# Altium project Taksimetre.PrjPcb (part 2 of 2)

## Sheet 01_Power_Regulations.SchDoc
size A4; DrawnBy: YILDIRIM DOĞRU
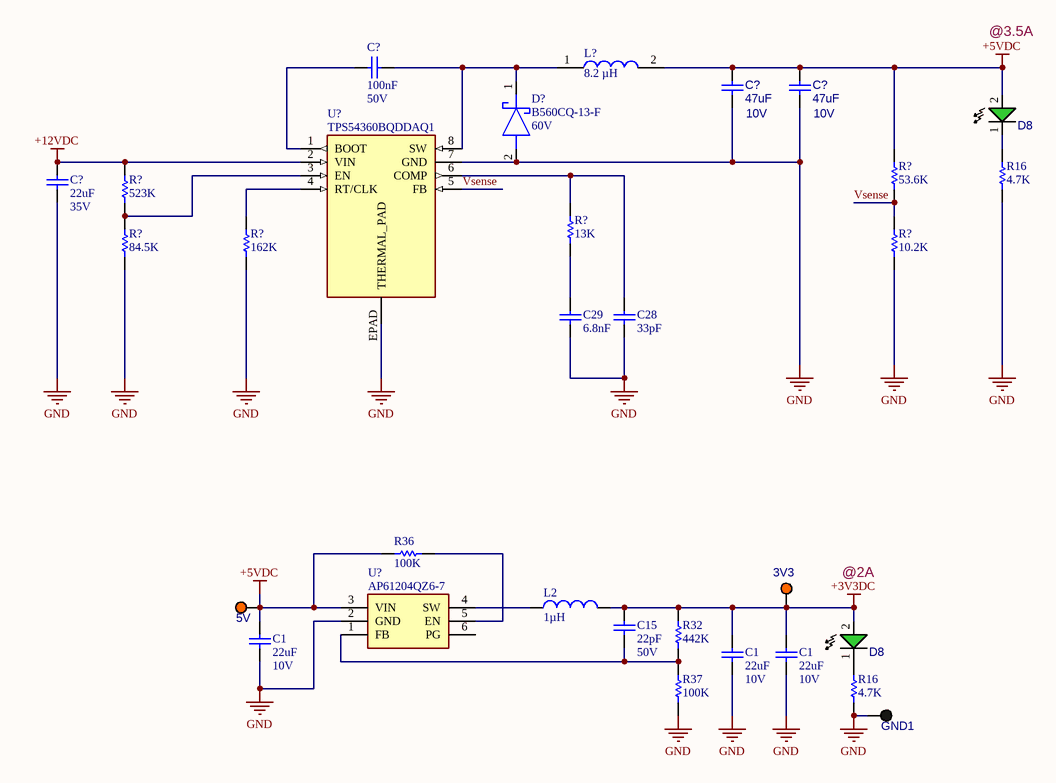
[diagram p9: 01_Power_Regulations.SchDoc]

### Parts
(Parts that share a designator on the sheet are numbered #1, #2 ... from top to bottom, then left to right.)
3V3  L-KLS8-TP5003  [TEST_POINT_ORANGE]  (value not drawn)
5V  L-KLS8-TP5003  [TEST_POINT_ORANGE]  (value not drawn)
C1#2  value 22uF  Voltage: 10V  [CAP_0805]  (hidden comment: CL21A226MPCLRNC)
C1#3  value 22uF  Voltage: 10V  [CAP_0805]  (hidden comment: CL21A226MPCLRNC)
C1#4  value 22uF  Voltage: 10V  [CAP_0805]  (hidden comment: CL21A226MPCLRNC)
C15#2  value 22pF  Voltage: 50V  [CAP_0603]  (hidden comment: CAP)
C28#2  value 33pF  [CAP_0603]  (hidden comment: CL10C330JB8NNNC)
C29#2  value 6.8nF  [CAP_0603]  (hidden comment: CC0603KRX7R9BB682)
C?#23  value 100nF  Voltage: 50V  [CAP_0603]  (hidden comment: CAP)
C?#24  value 47uF  Voltage: 10V  [CAP_1206]  (hidden comment: CL31A476MPHNNNE)
C?#25  value 47uF  Voltage: 10V  [CAP_1206]  (hidden comment: CL31A476MPHNNNE)
C?#26  value 22uF  Voltage: 35V  [CAP_0805]  (hidden comment: GMC21X5R226M35NT)
D8#2  LTST-C190TGKT  [LED_0603_GREEN]  (value not drawn)
D8#3  LTST-C190TGKT  [LED_0603_GREEN]  (value not drawn)
D?#11  B560CQ-13-F  value 60V  [DIOM7959X250N]
GND1  L-KLS8-TP5001  [TEST_POINT_BLACK]  (value not drawn)
L2#2  value 1µH  [FPI0302-2R2M]  (hidden comment: FPI0302-1R0M)
L?#2  value 8.2 µH  [7447797360]  (hidden comment: 7447797820)
R16#6  value 4.7K  [RES_0603]  (hidden comment: 0603SAF4701T5E)
R16#7  value 4.7K  [RES_0603]  (hidden comment: 0603SAF4701T5E)
R32  value 442K  [RES_0603]  (hidden comment: RES)
R36  value 100K  [RES_0603]  (hidden comment: RES)
R37  value 100K  [RES_0603]  (hidden comment: RES)
R?#29  value 53.6K  [RES_0402]  (hidden comment: 0402WGF5362TCE)
R?#30  value 523K  [RES_0402]  (hidden comment: 0402WGF5233TCE)
R?#31  value 10.2K  [RES_0402]  (hidden comment: 0402WGF1022TCE)
R?#32  value 13K  [RES_0402]  (hidden comment: 0402WGF1302TCE)
R?#33  value 84.5K  [RES_0402]  (hidden comment: 0402WGF8452TCE)
R?#34  value 162K  [RES_0402]  (hidden comment: 0402WGF1623TCE)
U?#7  TPS54360BQDDAQ1  [DDA8_3P1X2P4_TEX]
U?#8  AP61204QZ6-7  [AP61204QZ67]

### Nets
+3V3DC: 3V3.1 C1#3.1 C1#4.1 C15#2.1 D8#3.2 L2#2.2 R32.1
+5VDC: 5V.1 C1#2.1 C?#24.1 C?#25.1 D8#2.2 L?#2.2 R36.1 R?#29.1 U?#8.3(VIN)
+12VDC: C?#26.1 R?#30.2 U?#7.2(VIN)
GND: C1#2.2 C1#3.2 C1#4.2 C28#2.2 C29#2.2 C?#24.2 C?#25.2 C?#26.2 D?#11.2(A) GND1.1 R16#6.1 R16#7.1 R37.1 R?#31.2 R?#33.1 R?#34.1 U?#7.7(GND) U?#7.EPAD(THERMAL_PAD) U?#8.2(GND)  [project net TVSS]
Vsense: R?#29.2 R?#31.1 U?#7.5(FB)
NetC15#2_2: C15#2.2 R32.2 R37.2 U?#8.1(FB)
NetC28#2_1: C28#2.1 R?#32.2 U?#7.6(COMP)
NetC29#2_1: C29#2.1 R?#32.1
NetC?#23_1: C?#23.1 U?#7.1(BOOT)
NetC?#23_2: C?#23.2 D?#11.1(K) L?#2.1 U?#7.8(SW)
NetD8#2_1: D8#2.1 R16#6.2
NetD8#3_1: D8#3.1 R16#7.2
NetL2#2_1: L2#2.1 U?#8.4(SW)
NetR36_2: R36.2 U?#8.5(EN)
NetR?#30_1: R?#30.1 R?#33.2 U?#7.3(EN)
NetR?#34_2: R?#34.2 U?#7.4(RT/CLK)

Not connected (* = marked no-connect by the designer): U?#8 6(PG)

### Notes on the sheet
- @3.5A
- @2A
- Title
- Size:
- Date:
- A4
- Drawn By:
- Number:
- Revision:
- File:

### Library data of the parts
3V3 5V = 5003: PC TEST POINT MINIATURE ORANGE 2.54MMX4.60MM; Manufacturer: KLS ELECTRONIC; Package: 1mm THT Pad; Manufacturer Part Number: L-KLS8-TP5003
C1#2-C1#4 = C01758: MLCC (2012) 0805 22uF 10VDC ±20% X5R; Manufacturer: Samsung; Manufacturer Part Number: CL21A226MPCLRNC
C15#2 = C01769: MLCC 0603 22pF 50VDC ±5% C0G (NP0); Manufacturer: Samsung; Manufacturer Part Number: CL10C220JB8NNNC
C28#2 = CL10C330JB8NNNC: MLCC (1608) 0603 33pF 50VDC ±5% C0G (NP0); Manufacturer: Samsung Electro-Mechanics America, Inc; Supplier 1: OZDISAN; Manufacturer Part Number: CL10C330JB8NNNC
C29#2 = CL10C330JB8NNNC: MLCC (1608) 0603 6.8nF 50VDC ±10% X7R; Manufacturer: YAGEO; Supplier 1: OZDISAN; Manufacturer Part Number: CC0603KRX7R9BB682
C?#23 = C01763: CAP CER 100nF 50VDC %10 X7R SMD; Manufacturer: Samsung; Manufacturer Part Number: CL10B104KB8NNNL
C?#24 C?#25 = CL31A106KBHNNNE: MLCC (3216) 1206 47uF 10VDC ±20% X5R; Manufacturer: SAMSUNG; Package: 1206 (3216 Metric); Manufacturer Part Number: CL31A476MPHNNNE
C?#26 = C01758: 22 µF ±20% 35V Ceramic Capacitor X5R 0805 (2012 Metric); Manufacturer: Cal-Chip Electronics, Inc.; Manufacturer Part Number: GMC21X5R226M35NT
D8#2 D8#3 = LTST-C190TGKT: LED SMD 0603 GREEN 71-450mcd 130° WATER CLEAR; Manufacturer: LITEON; Package: 0603(1608 Metric); Manufacturer Part Number: LTST-C190TGKT; Value: GREEN
D?#11 = B560CQ-13-F: DIODE SCHOTTKY 60V 5A SMC; Manufacturer: Diodes Incorporated; Manufacturer Part Number: B560CQ-13-F
GND1 = 5001: PC TEST POINT MINIATURE BLACK 2.54MMX4.60MM; Manufacturer: KLS ELECTRONIC; Package: 1mm THT Pad; Manufacturer Part Number: L-KLS8-TP5001
L2#2 = IND0000019: INDUCTOR POWER 1UH 3.3X3MM SMD; Manufacturer: Core Master; Manufacturer Part Number: FPI0302-1R0M
L?#2 = 7447797820: 8.2 µH Shielded Drum Core, Wirewound Inductor 5.05 A 28.6mOhm Max Nonstandard; Manufacturer: Wurth Elektronik; Manufacturer Part Number: 7447797820
R16#6 R16#7 = 0603SAF4701T5E: RES.(1608) 0603 4.7K Ohms 1% 1/10W-S 100PPM; Manufacturer: ROYALOHM; Supplier 1: Ozdisan; Manufacturer Part Number: 0603SAF4701T5E
R32 = R03014: RES 0603 442K Ohms 1% 1/10W-S 100PPM; Manufacturer: ROYALOHM; Manufacturer Part Number: 0603SAF4423T5E
R36 R37 = R03011: RES 0603 100K Ohms 1% 1/10W-S 100PPM; Manufacturer: ROYALOHM; Manufacturer Part Number: 0603SAF1003T5E
R?#29 = R03000: RES.(1005) 0402 53.6K Ohms 1% 1/16W 100PPM; Manufacturer: ROYALOHM; Manufacturer Part Number: 0402WGF5362TCE
R?#30 = R03000: RES.(1005) 0402 523K Ohms 1% 1/16W 100PPM; Manufacturer: ROYALOHM; Manufacturer Part Number: 0402WGF5233TCE
R?#31 = R03000: RES.(1005) 0402 10.2K Ohms 1% 1/16W 100PPM; Manufacturer: ROYALOHM; Manufacturer Part Number: 0402WGF1022TCE
R?#32 = R03000: RES.(1005) 0402 13K Ohms 1% 1/16W 100PPM; Manufacturer: ROYALOHM; Manufacturer Part Number: 0402WGF1302TCE
R?#33 = R03000: RES.(1005) 0402 84.5K Ohms 1% 1/16W 100PPM; Manufacturer: ROYALOHM; Manufacturer Part Number: 0402WGF8452TCE
R?#34 = R03000: RES.(1005) 0402 162K Ohms 1% 1/16W 100PPM; Manufacturer: ROYALOHM; Manufacturer Part Number: 0402WGF1623TCE
U?#7 = TPS54360BQDDAQ1: Automotive, 60V Input, 3.5A, Step-Down DC-DC Converter With Eco-mode&trade; 8-SO PowerPAD -40 to 125; Manufacturer: Texas Instruments; Copyright: Copyright (C) 2026 Ultra Librarian. All rights reserved.; Manufacturer Part Number: TPS54360BQDDAQ1; RefDes: RefDes; Type: Type
U?#8 = AP61204QZ6-7: Integrated Circuit; Manufacturer_Name: Diodes Incorporated; Datasheet Link: https://www.diodes.com/datasheet/download/AP61204Q.pdf; Height: 0.6mm; Manufacturer_Part_Number: AP61204QZ6-7

## Nets that join several sheets
3V3_IN: 06_RFID_RTC_Storage (11 pins), 08_Display (U1#2.6 U1#2.20)
+3V3DC: 02_MCU_ESP32P4 (R1#1.2 R2#1.2 U?#1.85 U?#1.86), 03_Vehicle_Interfaces (C?#14.2 R?#10.1 U?#2.5), 04_USB_UART_Service (6 pins), 01_Power_Regulations (7 pins)
+5VDC: 03_Vehicle_Interfaces (C?#13.2 U?#2.3), 04_USB_UART_Service (R?#15.2 U?#3.3 U?#3.5), 01_Power_Regulations (9 pins)
+12VDC: 01_Power_Protection (8 pins), 05_Taxi_Toplight (JP1.5 R?#20.1 R?#21.1 R?#26.1), 01_Power_Regulations (C?#26.1 R?#30.2 U?#7.2)
TVSS: 01_Power_Protection (18 pins), 02_MCU_ESP32P4 (11 pins), 03_Vehicle_Interfaces (10 pins), 04_USB_UART_Service (23 pins), 05_Taxi_Toplight (10 pins), 06_RFID_RTC_Storage (22 pins), 07_LTE_GNSS (87 pins), 08_Display (37 pins), 01_Power_Regulations (19 pins)
USBD_N: 02_MCU_ESP32P4 (U?#1.48), 04_USB_UART_Service (J?#2.2)
USBD_P: 02_MCU_ESP32P4 (U?#1.49), 04_USB_UART_Service (J?#2.3)